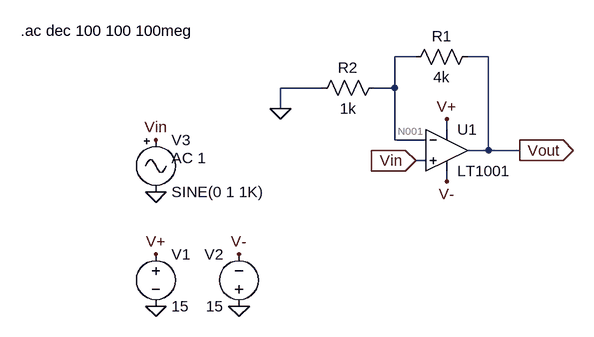
[diagram p0: schematic Simulación AC analysis.asc]
Simulación AC analysis.asc, the LTspice schematic file:
Version 4
SHEET 1 928 680
WIRE 624 -384 592 -384
WIRE 736 -384 704 -384
WIRE 480 -336 416 -336
WIRE 592 -336 592 -384
WIRE 592 -336 560 -336
WIRE 416 -304 416 -336
WIRE 672 -272 672 -288
WIRE 592 -256 592 -336
WIRE 640 -256 592 -256
WIRE 736 -240 736 -384
WIRE 736 -240 704 -240
WIRE 784 -240 736 -240
WIRE 640 -224 624 -224
WIRE 672 -192 672 -208
FLAG 224 0 0
FLAG 352 0 0
FLAG 224 -80 V+
FLAG 352 -80 V-
FLAG 672 -288 V+
FLAG 672 -192 V-
FLAG 224 -176 0
FLAG 224 -256 Vin
FLAG 624 -224 Vin
IOPIN 624 -224 In
FLAG 416 -304 0
FLAG 784 -240 Vout
IOPIN 784 -240 Out
SYMBOL voltage 224 -96 R0
WINDOW 123 0 0 Left 0
WINDOW 39 0 0 Left 0
SYMATTR InstName V1
SYMATTR Value 15
SYMBOL voltage 352 16 R180
WINDOW 0 24 96 Left 2
WINDOW 3 24 16 Left 2
WINDOW 123 0 0 Left 0
WINDOW 39 0 0 Left 0
SYMATTR InstName V2
SYMATTR Value 15
SYMBOL OpAmps\\LT1001 672 -304 R0
SYMATTR InstName U1
SYMBOL res 720 -400 R90
WINDOW 0 0 56 VBottom 2
WINDOW 3 32 56 VTop 2
SYMATTR InstName R1
SYMATTR Value 4k
SYMBOL res 576 -352 R90
WINDOW 0 0 56 VBottom 2
WINDOW 3 32 56 VTop 2
SYMATTR InstName R2
SYMATTR Value 1k
SYMBOL Misc\\signal 224 -272 R0
WINDOW 123 24 44 Left 2
WINDOW 39 0 0 Left 0
SYMATTR Value2 AC 1
SYMATTR InstName V3
TEXT 16 -424 Left 2 !.ac dec 100 100 100meg

The netlist it stands for:
* Simulación AC analysis.asc
V1 V+ 0 15
V2 0 V- 15
XU1 Vin N001 V+ V- Vout LT1001  ; pins In+ In- V+ V- OUT
R1 Vout N001 4k
R2 N001 0 1k
V3 Vin 0 SINE(0 1 1K) AC 1
.ac dec 100 100 100meg
.lib LTC.lib
.backanno
.end

* Results of the author's LTspice run, read from the files saved beside the schematic
* Operating Point, zero values left out:
*   V(v+) = 15 V
*   V(v-) = -15 V
*   I(V1) = -2.25 mA
*   I(V2) = -2.25 mA
*   Ix(u1:3) = 2.25 mA
*   Ix(u1:4) = -2.25 mA
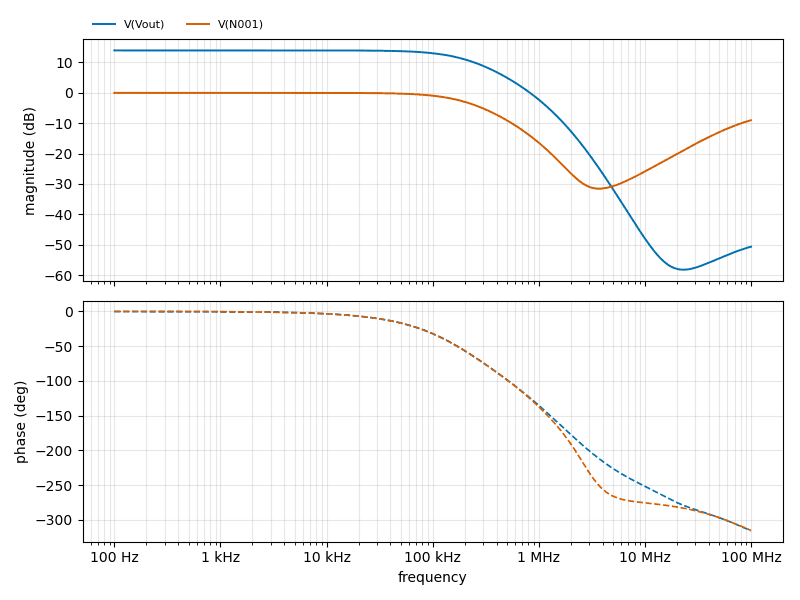
[diagram p1: AC Analysis of Simulación AC analysis.asc, plotted from the saved traces]
* AC Analysis, 1 run:
*   V(Vout): 13.98 dB at 100 Hz, -50.65 dB at 100 MHz, peak 13.98 dB at 100 Hz, 3 dB below the peak at 203.1 kHz
*   V(N001): -0.00 dB at 100 Hz, -9.00 dB at 100 MHz, peak -0.00 dB at 100 Hz, 3 dB below the peak at 202.6 kHz